# EAGLE design msxrom (EAGLE 9.0.1)
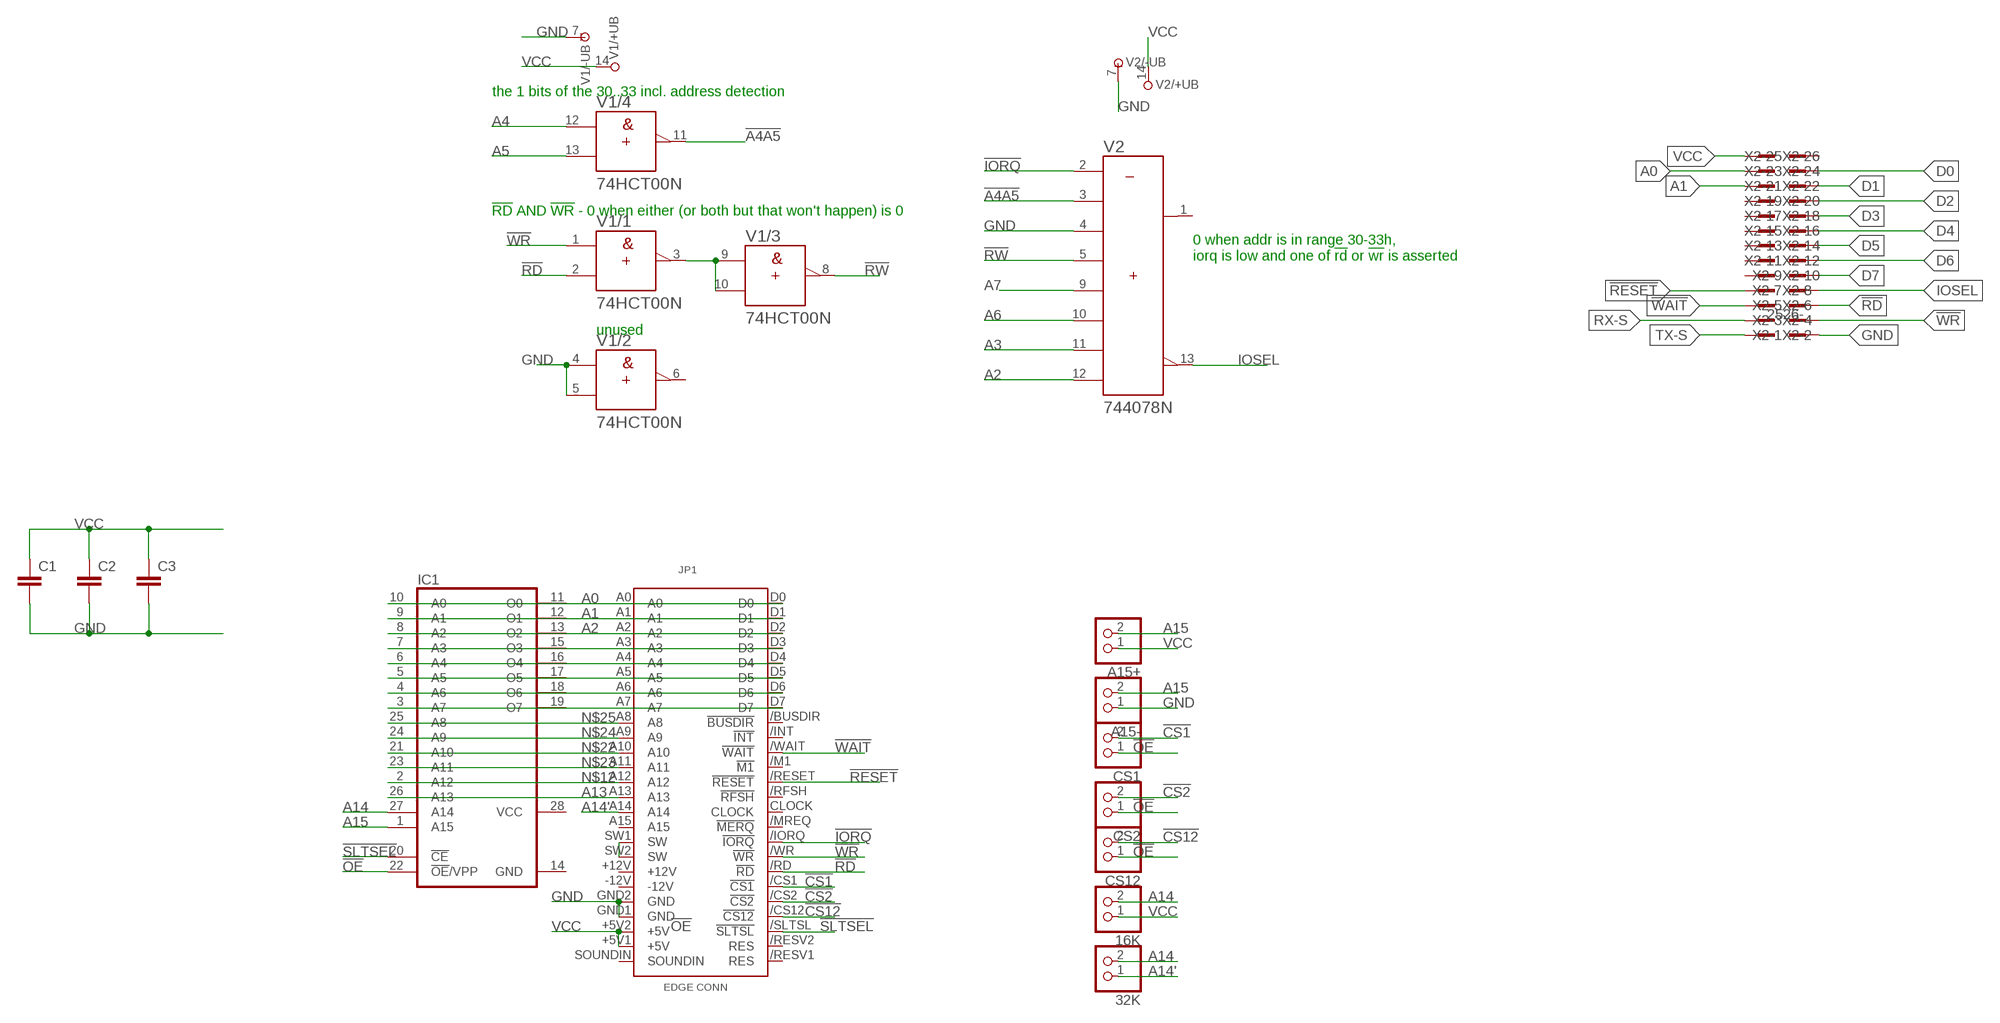
[diagram p0: schematic, sheet 1]

## Parts
16K  PINHD-1X2  [1X02]
32K  PINHD-1X2  [1X02]
A15+  PINHD-1X2  [1X02]
A15-  PINHD-1X2  [1X02]
C1  C-EU050-025X075  [C050-025X075]
C2  C-EU050-025X075  [C050-025X075]
C3  C-EU050-025X075  [C050-025X075]
CS1  PINHD-1X2  [1X02]
CS2  PINHD-1X2  [1X02]
CS12  PINHD-1X2  [1X02]
IC1  27C512D  [DIL28-6]
JP1  MSXCART  [MSXCART]
V1  74HCT00N  [DIL14]
V2  744078N  [DIL14]
X2  2526-  [PAK100/2500-26]

## Nets
!A4A5: V1.11(/4:Y) V2.3(B)
!CS1: CS1.2 JP1./CS1(!CS1)
!CS2: CS2.2 JP1./CS2(!CS2)
!CS12: CS12.2 JP1./CS12(!CS12)
!IORQ: JP1./IORQ(!IORQ) V2.2(A)
!OE: CS1.1 CS2.1 CS12.1 IC1.22(!OE!/VPP)
!RD: JP1./RD(!RD) V1.2(/1:B) X2.5
!RESET: JP1./RESET(!RESET) X2.8
!RW: V1.8(/3:Y) V2.5(D)
!SLTSEL: IC1.20(!CE) JP1./SLTSL(!SLTSL)
!WAIT: JP1./WAIT(!WAIT) X2.6
!WR: JP1./WR(!WR) V1.1(/1:A) X2.3
A0: IC1.10(A0) JP1.A0 X2.24
A1: IC1.9(A1) JP1.A1 X2.22
A2: IC1.8(A2) JP1.A2 V2.12(H)
A3: IC1.7(A3) JP1.A3 V2.11(G)
A4: IC1.6(A4) JP1.A4 V1.12(/4:A)
A5: IC1.5(A5) JP1.A5 V1.13(/4:B)
A6: IC1.4(A6) JP1.A6 V2.10(F)
A7: IC1.3(A7) JP1.A7 V2.9(E)
A13: IC1.26(A13) JP1.A13
A14: 16K.2 32K.2 IC1.27(A14)
A14': 32K.1 JP1.A14
A15: A15+.2 A15-.2 IC1.1(A15)
D0: IC1.11(O0) JP1.D0 X2.23
D1: IC1.12(O1) JP1.D1 X2.21
D2: IC1.13(O2) JP1.D2 X2.19
D3: IC1.15(O3) JP1.D3 X2.17
D4: IC1.16(O4) JP1.D4 X2.15
D5: IC1.17(O5) JP1.D5 X2.13
D6: IC1.18(O6) JP1.D6 X2.11
D7: IC1.19(O7) JP1.D7 X2.9
GND: A15-.1 C1.2 C2.2 C3.2 JP1.GND1(GND) JP1.GND2(GND) V1.4(/2:A) V1.5(/2:B) V1.7(/-UB:-UB) V2.4(C) V2.7(-UB) X2.1
IOSEL: V2.13(W) X2.7
N$9: JP1.SW1(SW) JP1.SW2(SW)
N$10: V1.3(/1:Y) V1.9(/3:A) V1.10(/3:B)
N$12: IC1.2(A12) JP1.A12
N$22: IC1.21(A10) JP1.A10
N$23: IC1.23(A11) JP1.A11
N$24: IC1.24(A9) JP1.A9
N$25: IC1.25(A8) JP1.A8
RX-S: X2.4
TX-S: X2.2
VCC: 16K.1 A15+.1 C1.1 C2.1 C3.1 JP1.+5V1(+5V) JP1.+5V2(+5V) V1.14(/+UB:+UB) V2.14(+UB) X2.26
Unconnected: JP1.+12V JP1.-12V JP1./BUSDIR(!BUSDIR) JP1./INT(!INT) JP1./M1(!M1) JP1./MREQ(!MERQ) JP1./RESV1(RES) JP1./RESV2(RES) JP1./RFSH(!RFSH) JP1.A15 JP1.CLOCK JP1.SOUNDIN V1.6(/2:Y) V2.1(Y) X2.10 X2.12 X2.14 X2.16 X2.18 X2.20 X2.25

## Notes on the sheet
- the 1 bits of the 30..33 incl. address detection
- !RD! AND !WR! - 0 when either (or both but that won't happen) is 0
- 0 when addr is in range 30-33h,
  iorq is low and one of !rd! or !wr! is asserted
- unused

## Power pins joined to a net without a drawn wire
GND: IC1.14(GND)
VCC: IC1.28(VCC)

## Library data of the parts
16K 32K A15+ A15- CS1 CS2 CS12 = pinhead-round:PINHD-1X2: PIN HEADER
C1-C3 = rcl:C-EU: CAPACITOR, European symbol
IC1 = memory-nec:27C512D: MEMORY; MPN: M27C512-10F1; OC_FARNELL: 1661676; OC_NEWARK: 56P9224
JP1 = msx-con:MSXCART
V1 = 74ttl-din:74*00: Quad 2-input NAND gate
V2 = 74ttl-din:74*4078: 8-input OR/NOR, complementary outputs
X2 = con-3m:2526-: 3M (TM) Pak 100 4-Wall Header Source: 3M; OC_FARNELL: unknown; OC_NEWARK: unknown

## Board
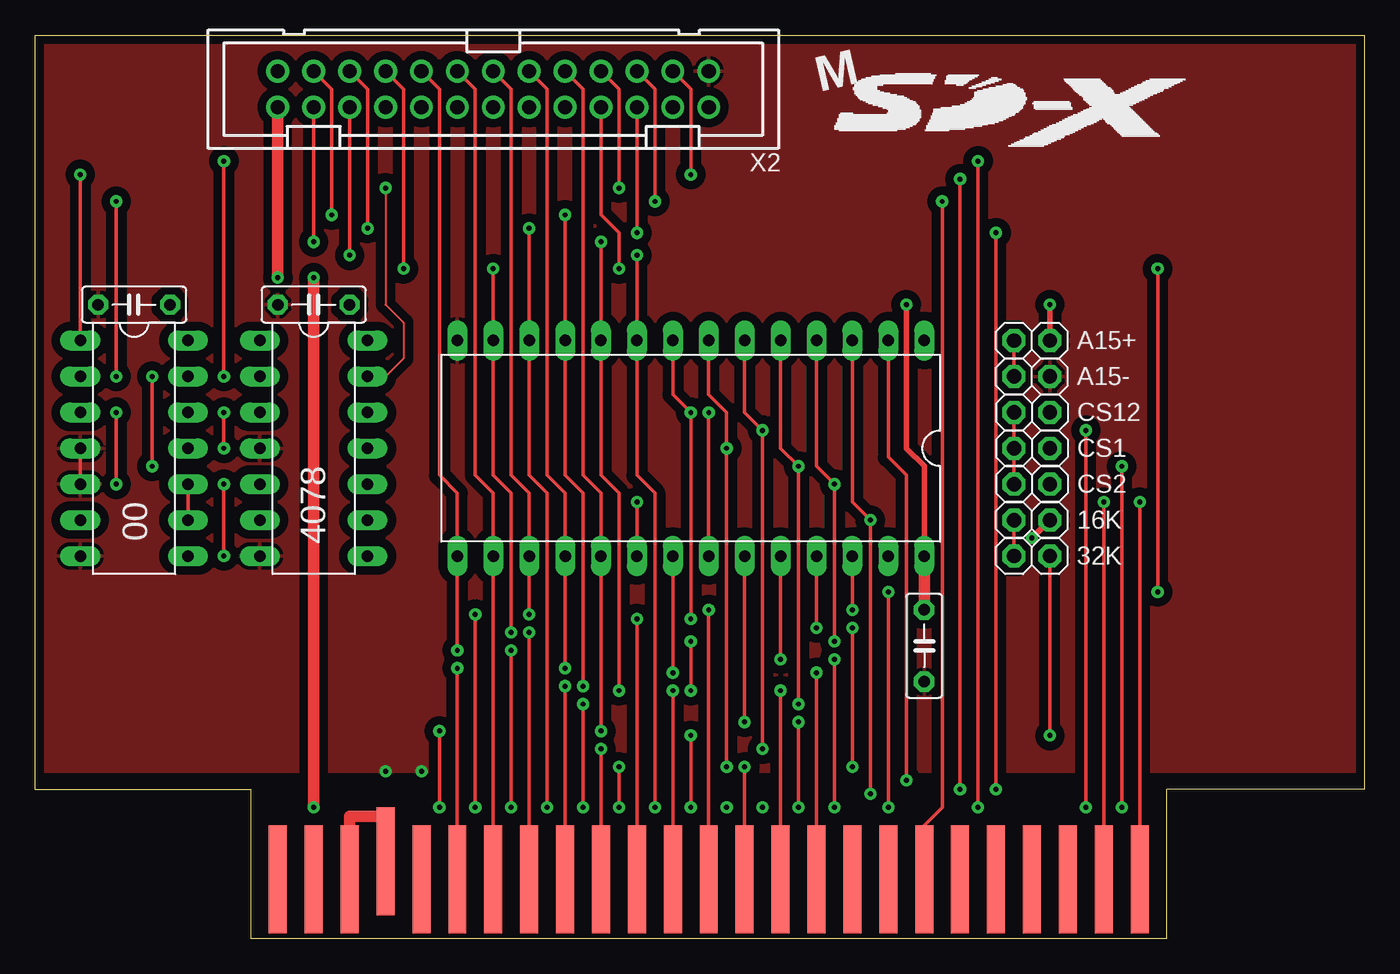
[diagram p1: board, top side]
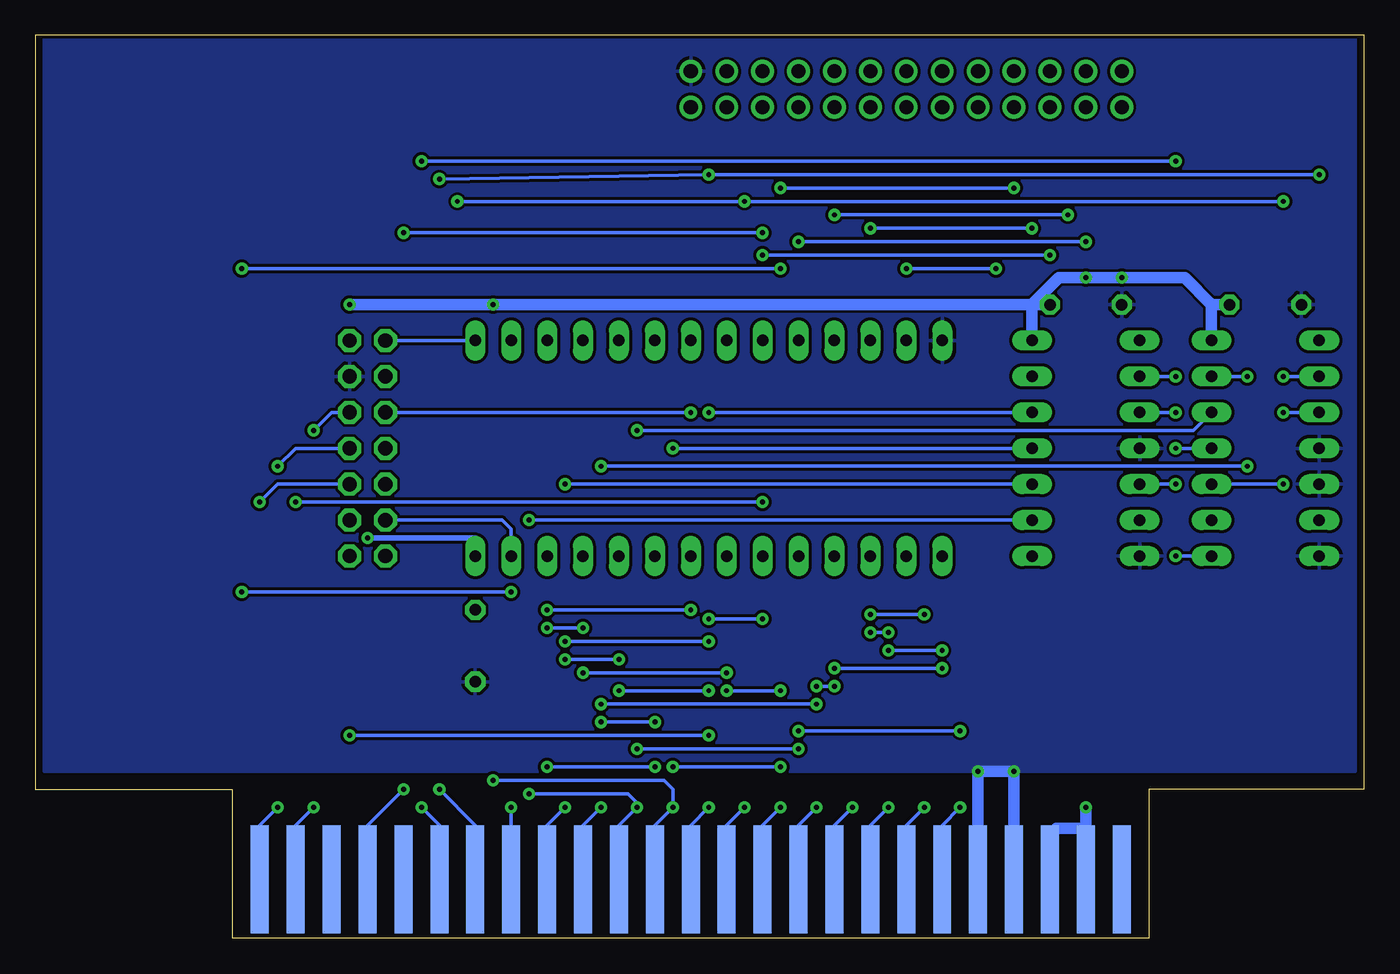
[diagram p2: board, bottom side, seen from below]

Size 93.98 x 63.88 mm. Coordinates in mm from the lower left corner, seen from the top.
Copper layers (1*16): Top 0.035mm / dielectric 1.5mm / Bottom 0.035mm
Design rules "SparkFun": minimum track width 8mil, minimum drill 20mil, track to track 8mil, track to pad 8mil, pad to pad 8mil, via to via 8mil, smd to smd 8mil, copper to edge 10mil, drill to drill 8mil, minimum pad ring 12mil, minimum via ring 10mil, stop-mask expansion 4mil, vias tented up to drill 25mil, thermal gap 10mil

### Footprints (pad centres in the part's own frame; a part is rotated, then mirrored left to right if it is on the bottom)
1X02 = drill 1.016 octagon: 1 -1.27,0; 2 1.27,0
C050-025X075 = drill 0.813 octagon: 1 -2.54,0; 2 2.54,0
DIL28-6 = drill 0.813 long: 1 -16.51,-7.62; 2 -13.97,-7.62; 3 -11.43,-7.62; 4 -8.89,-7.62; 5 -6.35,-7.62; 6 -3.81,-7.62; 7 -1.27,-7.62; 8 1.27,-7.62; 9 3.81,-7.62; 10 6.35,-7.62; 11 8.89,-7.62; 12 11.43,-7.62; 13 13.97,-7.62; 14 16.51,-7.62; 15 16.51,7.62; 16 13.97,7.62; 17 11.43,7.62; 18 8.89,7.62; 19 6.35,7.62; 20 3.81,7.62; 21 1.27,7.62; 22 -1.27,7.62; 23 -3.81,7.62; 24 -6.35,7.62; 25 -8.89,7.62; 26 -11.43,7.62; 27 -13.97,7.62; 28 -16.51,7.62
MSXCART = smd 1.27 x 7.62 bottom: +5V1 -24.13,-36.83; +5V2 -21.59,-36.83; /CS1 34.29,-36.83; /CS12 31.75,-36.83; /IORQ 21.59,-36.83; /M1 24.13,-36.83; /RESET 16.51,-36.83; /RESV2 29.21,-36.83; /WAIT 26.67,-36.83; /WR 19.05,-36.83; A1 1.27,-36.83; A3 -1.27,-36.83; A5 -3.81,-36.83; A7 8.89,-36.83; A9 13.97,-36.83; A11 11.43,-36.83; A12 6.35,-36.83; A14 3.81,-36.83; D1 -6.35,-36.83; D3 -8.89,-36.83; D5 -11.43,-36.83; D7 -13.97,-36.83; GND1 -19.05,-36.83; GND2 -16.51,-36.83; SOUNDIN -26.67,-36.83 | smd 1.27 x 7.62: +12V -24.13,-36.83; -12V -26.67,-36.83; /BUSDIR 24.13,-36.83; /CS2 34.29,-36.83; /INT 26.67,-36.83; /MREQ 21.59,-36.83; /RD 19.05,-36.83; /RESV1 16.51,-36.83; /RFSH 29.21,-36.83; /SLTSL 31.75,-36.83; A0 1.27,-36.83; A2 -1.27,-36.83; A4 -3.81,-36.83; A6 8.89,-36.83; A8 6.35,-36.83; A10 11.43,-36.83; A13 3.81,-36.83; A15 13.97,-36.83; CLOCK -16.51,-36.83; D0 -6.35,-36.83; D2 -8.89,-36.83; D4 -11.43,-36.83; D6 -13.97,-36.83; SW1 -19.05,-35.56; SW2 -21.59,-36.83
DIL14 = drill 0.813 long: 1 -7.62,-3.81; 2 -5.08,-3.81; 3 -2.54,-3.81; 4 0,-3.81; 5 2.54,-3.81; 6 5.08,-3.81; 7 7.62,-3.81; 8 7.62,3.81; 9 5.08,3.81; 10 2.54,3.81; 11 0,3.81; 12 -2.54,3.81; 13 -5.08,3.81; 14 -7.62,3.81
PAK100/2500-26 = drill 1 pad 1.422: 1 -15.24,-1.27; 2 -15.24,1.27; 3 -12.7,-1.27; 4 -12.7,1.27; 5 -10.16,-1.27; 6 -10.16,1.27; 7 -7.62,-1.27; 8 -7.62,1.27; 9 -5.08,-1.27; 10 -5.08,1.27; 11 -2.54,-1.27; 12 -2.54,1.27; 13 0,-1.27; 14 0,1.27; 15 2.54,-1.27; 16 2.54,1.27; 17 5.08,-1.27; 18 5.08,1.27; 19 7.62,-1.27; 20 7.62,1.27; 21 10.16,-1.27; 22 10.16,1.27; 23 12.7,-1.27; 24 12.7,1.27; 25 15.24,-1.27; 26 15.24,1.27

### Placement (x,y rotation side)
16K  70.48,29.59 180 top
32K  70.48,27.05 180 top
A15+  70.48,42.29 180 top
A15-  70.48,39.75 180 top
C1  6.98,44.83 180 top
C2  19.68,44.83 180 top
C3  62.86,20.7 270 top
CS1  70.48,34.67 0 top
CS2  70.48,32.13 0 top
CS12  70.48,37.21 0 top
IC1  46.35,34.67 180 top
JP1  43.81,41.02 0 top
V1  6.98,34.67 270 top
V2  19.68,34.67 270 top
X2  32.38,60.07 180 top

### Tracks (layer width: path | path; a pad name or v marks a point on that pad's centre or on a via)
!A4A5  (via drill 0.35)
  Top 0.254: v13.33,37.21 v13.33,34.67
  Bottom 0.254: V2.3 v13.33,37.21 | v13.33,34.67 V1.11
!CS1  (via drill 0.35)
  Top 0.254: v76.83,9.27 v76.83,33.4
  Bottom 0.254: JP1./CS1 78.11,8 v76.83,9.27 | v76.83,33.4 75.56,34.67 CS1.2
!CS2  (via drill 0.35)
  Top 0.254: JP1./CS2 v78.11,30.86
  Bottom 0.254: v78.11,30.86 76.83,32.13 CS2.2
!CS12  (via drill 0.35)
  Top 0.254: v74.3,9.27 v74.3,35.94
  Bottom 0.254: v74.3,9.27 75.56,8 JP1./CS12 | v74.3,35.94 73.03,37.21 CS12.2
!IORQ  (via drill 0.35)
  Top 0.254: v66.67,9.27 v66.67,54.99 | v13.33,54.99 v13.33,39.75
  Bottom 0.254: JP1./IORQ 65.41,8 v66.67,9.27 | v66.67,54.99 v13.33,54.99 | v13.33,39.75 V2.2
!OE  (via drill 0.35)
  Top 0.254: CS12.1 CS1.1 CS2.1 | IC1.22 v47.62,37.21
  Bottom 0.254: v47.62,37.21 CS12.1
!RD  (via drill 0.35)
  Top 0.254: JP1./RD 62.86,8 64.14,9.27 v64.14,52.13 | v5.71,52.13 v5.71,39.75 | v43.81,52.13 43.81,60.07 X2.5
  Bottom 0.254: v64.14,52.13 v43.81,52.13 v5.71,52.13 | v5.71,39.75 V1.2
!RESET  (via drill 0.35)
  Top 0.254: v60.32,9.27 v60.32,24.51 | v79.38,24.51 v79.38,47.37 | v41.27,47.37 41.27,49.91 40,51.18 X2.8
  Bottom 0.254: JP1./RESET v60.32,9.27 | v60.32,24.51 v79.38,24.51 | v79.38,47.37 v41.27,47.37
!RW  (via drill 0.35)
  Top 0.254: v13.33,32.13 v13.33,27.05
  Bottom 0.254: V2.5 v13.33,32.13 | v13.33,27.05 V1.8
!SLTSEL  (via drill 0.35)
  Top 0.254: JP1./SLTSL v75.56,30.86 | v42.55,30.86 IC1.20
  Bottom 0.254: v75.56,30.86 v42.55,30.86
!WAIT  (via drill 0.35)
  Top 0.254: v67.94,10.54 v67.94,49.91 | X2.6 v42.55,49.91
  Bottom 0.254: JP1./WAIT 70.48,8 v67.94,10.54 | v67.94,49.91 v42.55,49.91
!WR  (via drill 0.35)
  Top 0.254: v65.41,10.54 v65.41,53.72 | v3.17,54.04 V1.1 | v46.35,54.04 46.35,60.07 X2.3
  Bottom 0.254: JP1./WR 62.86,8 v65.41,10.54 | v65.41,53.72 v46.35,54.04 v3.17,54.04
A0  (via drill 0.35)
  Top 0.254: v45.09,17.53 JP1.A0 | v41.27,17.53 41.27,31.5 40,32.77 IC1.10 v40,49.28 | v19.68,49.28 X2.24
  Bottom 0.254: v41.27,17.53 v45.09,17.53 | v40,49.28 v19.68,49.28
A1  (via drill 0.35)
  Top 0.254: v43.81,9.27 43.81,31.5 42.55,32.77 IC1.9 v42.55,48.32 | v22.22,48.32 X2.22
  Bottom 0.254: JP1.A1 45.09,8 v43.81,9.27 | v42.55,48.32 v22.22,48.32
A2  (via drill 0.35)
  Top 0.254: IC1.8 45.09,38.48 v46.35,37.21 v46.35,22.61 | v42.55,22.61 JP1.A2
  Bottom 0.254: v46.35,22.61 v42.55,22.61 | v46.35,37.21 V2.12
A3  (via drill 0.35)
  Top 0.254: IC1.7 47.62,38.48 48.89,37.21 v48.89,34.67 v48.89,12.13 | v41.27,12.13 v41.27,9.27
  Bottom 0.254: JP1.A3 42.55,8 v41.27,9.27 | v48.89,12.13 v41.27,12.13 | V2.11 v48.89,34.67
A4  (via drill 0.35)
  Top 0.254: IC1.6 50.16,37.21 v51.44,35.94 v51.44,13.4 | v40,13.4 JP1.A4
  Bottom 0.254: v51.44,13.4 v40,13.4 | V1.12 12.06,35.94 v51.44,35.94
A5  (via drill 0.35)
  Top 0.254: IC1.5 52.7,34.67 v53.98,33.4 v53.98,16.57 | v38.73,16.57 v38.73,9.27 | v8.25,39.75 v8.25,33.4
  Bottom 0.254: JP1.A5 40,8 v38.73,9.27 | v53.98,16.57 v38.73,16.57 | V1.13 v8.25,39.75 | v8.25,33.4 v53.98,33.4
A6  (via drill 0.35)
  Top 0.254: IC1.4 55.24,33.4 v56.52,32.13 v56.52,21.02 | v46.35,21.02 v46.35,17.53 | v52.7,17.53 JP1.A6
  Bottom 0.254: v56.52,21.02 v46.35,21.02 | v46.35,17.53 v52.7,17.53 | V2.10 v56.52,32.13
A7  (via drill 0.35)
  Top 0.254: IC1.3 57.78,30.86 v59.05,29.59 59.05,27.05 v59.05,10.22
  Bottom 0.254: JP1.A7 52.7,8 v51.44,9.27 51.44,9.59 52.07,10.22 v59.05,10.22 | V2.9 v59.05,29.59
A13  (via drill 0.35)
  Top 0.254: v47.62,23.24 JP1.A13 | IC1.26 v57.78,23.24
  Bottom 0.254: v57.78,23.24 v47.62,23.24
A14
  Top 0.254: 32K.2 16K.2
  Bottom 0.254: IC1.27 60.32,28.96 60.96,29.59 16K.2
A14'  (via drill 0.35)
  Top 0.254: v46.35,9.27 v46.35,14.35 | v71.75,14.35 32K.1
  Bottom 0.254: JP1.A14 47.62,8 v46.35,9.27 | v46.35,14.35 v71.75,14.35
A15
  Top 0.254: A15+.2 A15-.2
  Bottom 0.254: IC1.1 A15+.2
D0  (via drill 0.35)
  Top 0.254: v38.73,17.84 38.73,31.5 37.46,32.77 IC1.11 v37.46,51.18 | v37.46,17.84 JP1.D0 | v20.95,51.18 20.95,60.07 X2.23
  Bottom 0.254: v38.73,17.84 v37.46,17.84 | v37.46,51.18 v20.95,51.18
D1  (via drill 0.35)
  Top 0.254: v36.2,9.27 36.2,31.5 34.92,32.77 IC1.12 v34.92,50.23 | v23.49,50.23 23.49,60.07 X2.21
  Bottom 0.254: JP1.D1 37.46,8 v36.2,9.27 | v34.92,50.23 v23.49,50.23
D2  (via drill 0.35)
  Top 0.254: v33.66,21.65 33.66,31.5 32.38,32.77 IC1.13 v32.38,47.37 | v34.92,21.65 JP1.D2 | v26.04,47.37 26.04,60.07 X2.19
  Bottom 0.254: v33.66,21.65 v34.92,21.65 | v32.38,47.37 v26.04,47.37
D3  (via drill 0.35)
  Top 0.254: v29.84,20.38 IC1.15 29.84,31.5 28.57,32.77 28.57,60.07 X2.17 | v33.66,20.38 v33.66,9.27
  Bottom 0.254: v29.84,20.38 v33.66,20.38 | JP1.D3 34.92,8 v33.66,9.27
D4
  Top 0.254: JP1.D4 IC1.16 32.38,31.5 31.12,32.77 31.12,60.07 X2.15
D5  (via drill 0.35)
  Top 0.254: v34.92,22.92 IC1.17 34.92,31.5 33.66,32.77 33.66,60.07 X2.13 | v31.12,22.92 v31.12,9.27
  Bottom 0.254: v34.92,22.92 v31.12,22.92 | JP1.D5 32.38,8 v31.12,9.27
D6  (via drill 0.35)
  Top 0.254: JP1.D6 v29.84,19.11 | v37.46,19.11 IC1.18 37.46,31.5 36.2,32.77 36.2,60.07 X2.11
  Bottom 0.254: v29.84,19.11 v37.46,19.11
D7  (via drill 0.35)
  Top 0.254: v28.57,9.27 v28.57,14.67 | v40,14.67 IC1.19 40,31.5 38.73,32.77 38.73,60.07 X2.9
  Bottom 0.254: JP1.D7 29.84,8 v28.57,9.27 | v28.57,14.67 v40,14.67
GND  (via drill 0.35)
  Top 0.254: V1.4 V1.5
  Bottom 0.813: JP1.GND1 v24.77,11.81 v27.3,11.81 JP1.GND2
  pour Top (isolate 0.61): 93.34,11.81 93.34,63.88 0.63,63.88 0.63,11.81
  pour Bottom: 0.63,63.88 93.34,63.88 93.34,11.81 0.63,11.81
IOSEL  (via drill 0.35)
  Top 0.152: v24.77,53.09 24.77,44.83 26.04,43.56 26.04,41.02 24.77,39.75 V2.13
  Top 0.254: v41.27,53.09 41.27,60.07 X2.7
  Bottom 0.254: v41.27,53.09 v24.77,53.09
N$9
  Top 0.813: 24.77,4.19 JP1.SW1 24.77,8.64 22.22,8.64 JP1.SW2
N$10  (via drill 0.35)
  Top 0.254: v5.71,37.21 v5.71,32.13 | V1.10 V1.9
  Bottom 0.254: V1.3 v5.71,37.21 | v5.71,32.13 V1.10
N$12  (via drill 0.35)
  Top 0.254: IC1.2 60.32,34.04 61.59,32.77 v61.59,11.18
  Bottom 0.254: JP1.A12 50.16,8 v48.89,9.27 48.89,10.54 49.53,11.18 v61.59,11.18
N$22  (via drill 0.35)
  Top 0.254: v55.24,18.8 JP1.A10 | IC1.21 v45.09,18.8
  Bottom 0.254: v45.09,18.8 v55.24,18.8
N$23  (via drill 0.35)
  Top 0.254: v53.98,15.3 v53.98,9.27 | IC1.23 v50.16,15.3
  Bottom 0.254: JP1.A11 55.24,8 v53.98,9.27 | v50.16,15.3 v53.98,15.3
N$24  (via drill 0.35)
  Top 0.254: v56.52,19.75 v56.52,9.27 | IC1.24 v52.7,19.75
  Bottom 0.254: JP1.A9 57.78,8 v56.52,9.27 | v52.7,19.75 v56.52,19.75
N$25  (via drill 0.35)
  Top 0.254: v57.78,21.97 v57.78,12.13 | v50.16,12.13 JP1.A8 | IC1.25 v55.24,21.97
  Bottom 0.254: v55.24,21.97 v57.78,21.97 | v57.78,12.13 v50.16,12.13
VCC  (via drill 0.35)
  Top 0.406: v71.75,44.83 A15+.1 | IC1.28 62.86,33.4 61.59,34.67 v61.59,44.83 | 16K.1 v70.48,28.32
  Top 0.813: v19.68,9.27 v19.68,46.74 | X2.26 v17.14,46.74 | IC1.28 C3.1
  Bottom 0.406: v70.48,28.32 62.86,28.32 IC1.28
  Bottom 0.813: 23.49,44.83 21.59,46.74 v19.68,46.74 v17.14,46.74 12.7,46.74 10.79,44.83 | 23.49,44.83 v61.59,44.83 v71.75,44.83 | 10.79,44.83 V1.14 | V2.14 23.49,44.83 | JP1.+5V2 22,3.96 | 22,3.96 22,1.04 | 19.68,6.73 19.91,6.96 19.91,7.53 20.15,7.77 21.76,7.77 22,7.53 22,3.96 | 19.68,6.73 JP1.+5V1 | v19.68,9.27 19.68,6.73 | C1.1 10.79,44.83 | C2.1 23.49,44.83

### Text on the board
tNames: M | 4078 | 00